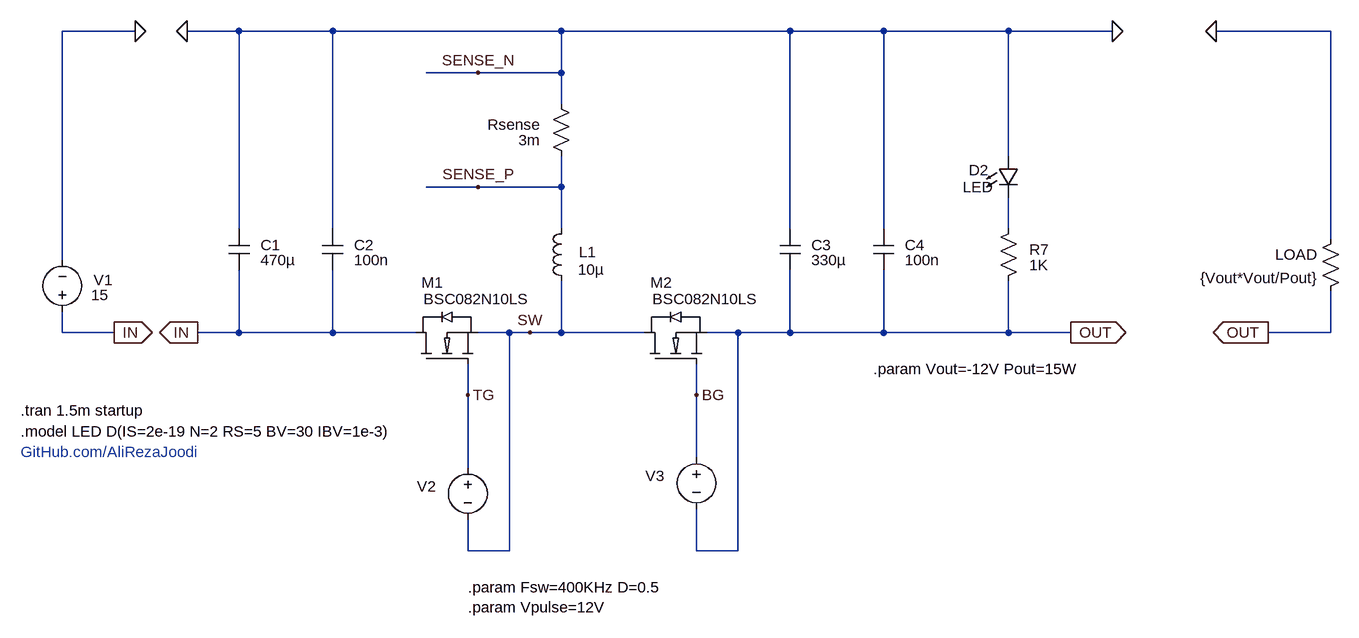
[diagram p0: schematic _PowerStage.asc]
_PowerStage.asc, the LTspice schematic file:
Version 4.1
SHEET 1 3996 1504
WIRE 1904 -128 1792 -128
WIRE 2064 -128 1984 -128
WIRE 2208 -128 2064 -128
WIRE 2560 -128 2208 -128
WIRE 2912 -128 2560 -128
WIRE 3056 -128 2912 -128
WIRE 3248 -128 3056 -128
WIRE 3408 -128 3248 -128
WIRE 3744 -128 3568 -128
WIRE 2432 -64 2352 -64
WIRE 2560 -64 2560 -128
WIRE 2560 -64 2432 -64
WIRE 2560 -16 2560 -64
WIRE 3248 64 3248 -128
WIRE 2432 112 2352 112
WIRE 2560 112 2560 64
WIRE 2560 112 2432 112
WIRE 2064 176 2064 -128
WIRE 2208 176 2208 -128
WIRE 2560 176 2560 112
WIRE 2912 176 2912 -128
WIRE 3056 176 3056 -128
WIRE 3248 176 3248 128
WIRE 3744 192 3744 -128
WIRE 1792 224 1792 -128
WIRE 1792 336 1792 304
WIRE 1872 336 1792 336
WIRE 2064 336 2064 240
WIRE 2064 336 2000 336
WIRE 2208 336 2208 240
WIRE 2208 336 2064 336
WIRE 2336 336 2208 336
WIRE 2480 336 2432 336
WIRE 2512 336 2480 336
WIRE 2560 336 2560 256
WIRE 2560 336 2512 336
WIRE 2688 336 2560 336
WIRE 2832 336 2784 336
WIRE 2912 336 2912 240
WIRE 2912 336 2832 336
WIRE 3056 336 3056 240
WIRE 3056 336 2912 336
WIRE 3248 336 3248 256
WIRE 3248 336 3056 336
WIRE 3344 336 3248 336
WIRE 3744 336 3744 272
WIRE 3744 336 3648 336
WIRE 2416 432 2416 384
WIRE 2768 432 2768 384
WIRE 2768 528 2768 432
WIRE 2416 544 2416 432
WIRE 2416 672 2416 624
WIRE 2480 672 2480 336
WIRE 2480 672 2416 672
WIRE 2768 672 2768 608
WIRE 2832 672 2832 336
WIRE 2832 672 2768 672
FLAG 3568 -128 0
FLAG 3344 336 OUT
IOPIN 3344 336 Out
FLAG 1872 336 IN
IOPIN 1872 336 Out
FLAG 2512 336 SW
FLAG 2416 432 TG
FLAG 3408 -128 0
FLAG 2432 112 SENSE_P
FLAG 2432 -64 SENSE_N
FLAG 2000 336 IN
IOPIN 2000 336 Out
FLAG 3648 336 OUT
IOPIN 3648 336 Out
FLAG 1984 -128 0
FLAG 1904 -128 0
FLAG 2768 432 BG
SYMBOL ind 2576 272 R180
WINDOW 0 -38 60 Left 2
WINDOW 3 -50 33 Left 2
SYMATTR InstName L1
SYMATTR Value 10µ
SYMATTR SpiceLine Rser=10m
SYMBOL res 2576 80 R180
WINDOW 0 48 64 Left 2
WINDOW 3 48 40 Left 2
SYMATTR InstName Rsense
SYMATTR Value 3m
SYMATTR SpiceLine tol=1
SYMBOL voltage 1792 320 M180
WINDOW 123 24 138 Left 2
WINDOW 39 24 117 Left 2
WINDOW 3 44 42 Left 2
WINDOW 0 48 65 Left 2
SYMATTR Value 15
SYMATTR InstName V1
SYMBOL res 3760 176 M0
SYMATTR InstName LOAD
SYMATTR Value {Vout*Vout/Pout}
SYMBOL cap 2192 240 M180
WINDOW 0 49 39 Left 2
WINDOW 3 49 16 Left 2
SYMATTR InstName C2
SYMATTR Value 100n
SYMATTR SpiceLine V=35
SYMBOL cap 3040 240 M180
WINDOW 0 49 39 Left 2
WINDOW 3 49 16 Left 2
SYMATTR InstName C4
SYMATTR Value 100n
SYMBOL LED 3232 64 R0
WINDOW 0 -45 22 Left 2
WINDOW 3 -54 48 Left 2
SYMATTR InstName D2
SYMATTR Value LED
SYMBOL res 3232 272 M180
WINDOW 0 48 64 Left 2
WINDOW 3 48 40 Left 2
SYMATTR InstName R7
SYMATTR Value 1K
SYMBOL cap 2048 240 M180
WINDOW 0 49 39 Left 2
WINDOW 3 49 16 Left 2
SYMATTR InstName C1
SYMATTR Value 470µ
SYMATTR SpiceLine V=35
SYMBOL cap 2896 240 M180
WINDOW 0 49 39 Left 2
WINDOW 3 49 16 Left 2
SYMATTR InstName C3
SYMATTR Value 330µ
SYMATTR SpiceLine V=35
SYMBOL MyLib\\Transistor_MOSFET_N\\MOSFET_N 2336 384 R270
WINDOW 0 125 9 VRight 2
WINDOW 3 100 12 VRight 2
SYMATTR InstName M1
SYMATTR Value BSC082N10LS
SYMBOL MyLib\\Transistor_MOSFET_N\\MOSFET_N 2688 384 R270
WINDOW 0 125 9 VRight 2
WINDOW 3 100 12 VRight 2
SYMATTR InstName M2
SYMATTR Value BSC082N10LS
SYMBOL voltage 2416 528 M0
WINDOW 3 39 69 Invisible 2
WINDOW 123 0 0 Left 0
WINDOW 0 49 45 Left 2
SYMATTR Value PULSE(0 12 0 {0.01/Fsw} {0.01/Fsw} {D/Fsw} {1/Fsw})
SYMATTR InstName V2
SYMATTR SpiceLine Rser=10
SYMBOL voltage 2768 512 M0
WINDOW 3 39 69 Invisible 2
WINDOW 123 0 0 Left 0
WINDOW 0 49 45 Left 2
SYMATTR Value PULSE(12 0 0 {0.01/Fsw} {0.01/Fsw} {D/Fsw} {1/Fsw})
SYMATTR InstName V3
SYMATTR SpiceLine Rser=10
TEXT 1728 456 Left 2 !.tran 1.5m startup
TEXT 1728 488 Left 2 !.model LED D(IS=2e-19 N=2 RS=5 BV=30 IBV=1e-3)
TEXT 1728 520 Left 2 ;GitHub.com/AliRezaJoodi
TEXT 3040 392 Left 2 !.param Vout=-12V Pout=15W
TEXT 2416 728 Left 2 !.param Fsw=400KHz D=0.5\n.param Vpulse=12V

The netlist it stands for:
* _PowerStage.asc
L1 SW SENSE_P 10µ Rser=10m
Rsense SENSE_P 0 3m tol=1
V1 IN 0 15
R§LOAD 0 OUT {Vout*Vout/Pout}
C2 IN 0 100n V=35
C4 OUT 0 100n
D2 0 N001 LED
R7 OUT N001 1K
C1 IN 0 470µ V=35
C3 OUT 0 330µ V=35
M1 IN TG SW SW BSC082N10LS
M2 SW BG OUT OUT BSC082N10LS
V2 TG SW PULSE(0 12 0 {0.01/Fsw} {0.01/Fsw} {D/Fsw} {1/Fsw}) Rser=10
V3 BG OUT PULSE(12 0 0 {0.01/Fsw} {0.01/Fsw} {D/Fsw} {1/Fsw}) Rser=10
.model D D
.lib standard.dio
.model NMOS NMOS
.model PMOS PMOS
.lib standard.mos
.tran 1.5m startup
.model LED D(IS=2e-19 N=2 RS=5 BV=30 IBV=1e-3)
* GitHub.com/AliRezaJoodi
.param Vout=-12V Pout=15W
.param Fsw=400KHz D=0.5
.param Vpulse=12V
.backanno
.end